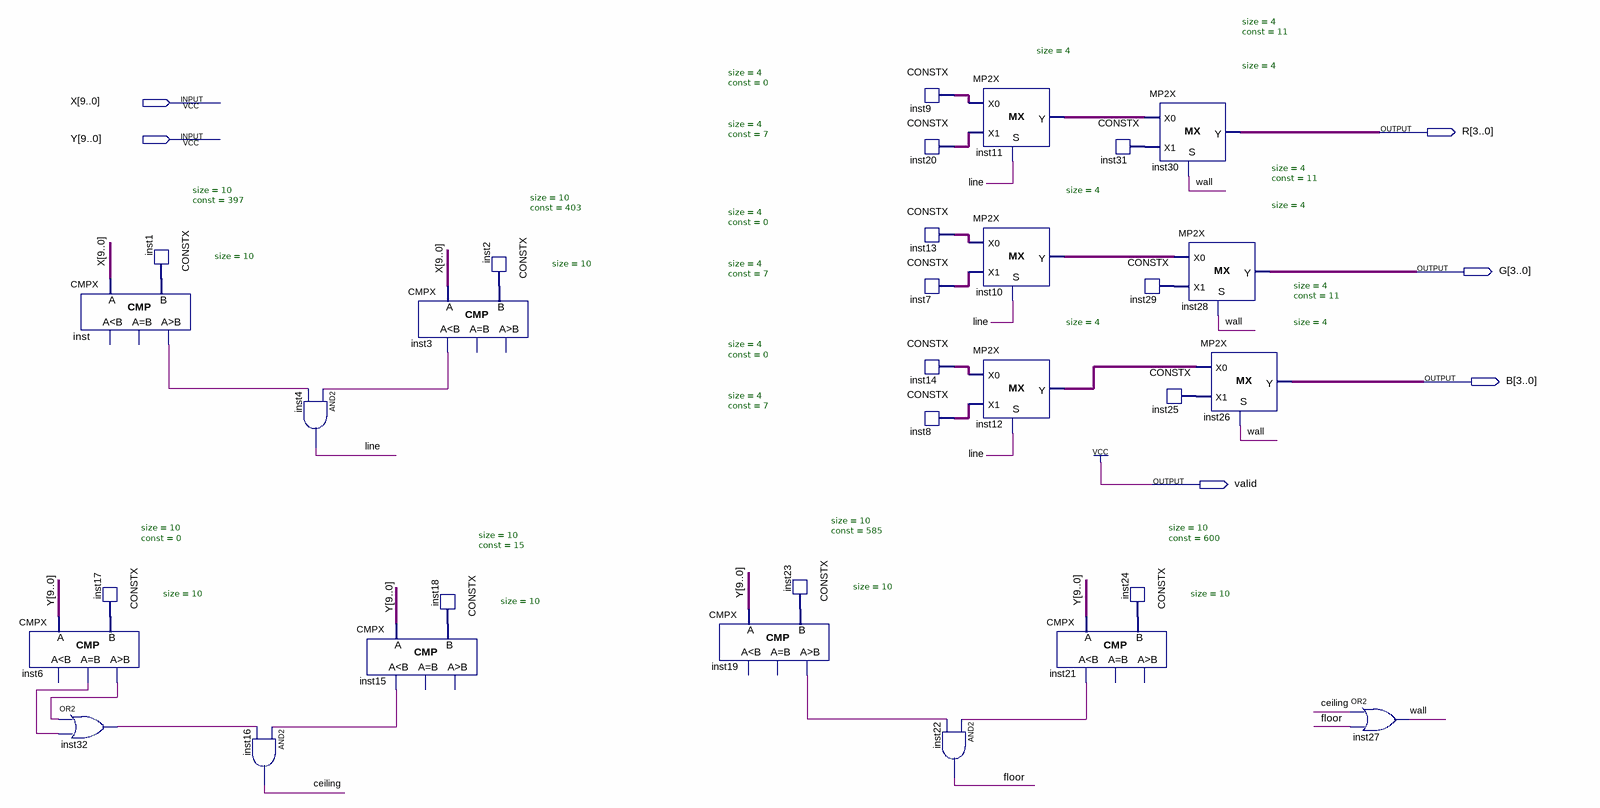
[diagram p0: schematic sheet]
// Quartus schematic Background.bdf as structural Verilog: 32 symbols, 6 pins
module Background (
  input  [9:0] X,
  input  [9:0] Y,
  output [3:0] R,
  output [3:0] G,
  output [3:0] B,
  output valid
);

  wire ceiling, floor, inst3_ls, inst6_eq, inst6_gr, inst15_ls, inst19_gr, inst21_ls, inst32_out, inst_gr,
       line, wall;
  wire [3:0] inst7_data, inst8_data, inst9_data, inst10_y, inst11_y, inst12_y, inst13_data, inst14_data,
       inst20_data, inst25_data, inst29_data, inst31_data;
  wire [9:0] inst1_data, inst2_data, inst17_data, inst18_data, inst23_data, inst24_data;

  CMPX #(.size(10)) inst6 (.A(Y), .B(inst17_data), .eq(inst6_eq), .gr(inst6_gr));  // open: ls
  CMPX #(.size(10)) inst (.A(X), .B(inst1_data), .gr(inst_gr));  // open: ls, eq
  or inst32 (inst32_out, inst6_gr, inst6_eq);
  CONSTX #(.size(10), .\const (397)) inst1 (.data(inst1_data));
  CONSTX #(.size(10), .\const (0)) inst17 (.data(inst17_data));
  and inst16 (ceiling, inst15_ls, inst32_out);
  and inst4 (line, inst3_ls, inst_gr);
  CMPX #(.size(10)) inst15 (.A(Y), .B(inst18_data), .ls(inst15_ls));  // open: eq, gr
  CMPX #(.size(10)) inst3 (.A(X), .B(inst2_data), .ls(inst3_ls));  // open: eq, gr
  CONSTX #(.size(10), .\const (15)) inst18 (.data(inst18_data));
  CONSTX #(.size(10), .\const (403)) inst2 (.data(inst2_data));
  CMPX #(.size(10)) inst19 (.A(Y), .B(inst23_data), .gr(inst19_gr));  // open: ls, eq
  CONSTX #(.size(10), .\const (585)) inst23 (.data(inst23_data));
  CONSTX #(.size(4), .\const (0)) inst9 (.data(inst9_data));
  CONSTX #(.size(4), .\const (7)) inst20 (.data(inst20_data));
  CONSTX #(.size(4), .\const (0)) inst13 (.data(inst13_data));
  CONSTX #(.size(4), .\const (7)) inst7 (.data(inst7_data));
  CONSTX #(.size(4), .\const (0)) inst14 (.data(inst14_data));
  CONSTX #(.size(4), .\const (7)) inst8 (.data(inst8_data));
  and inst22 (floor, inst21_ls, inst19_gr);
  MP2X #(.size(4)) inst11 (.S(line), .X0(inst9_data), .X1(inst20_data), .Y(inst11_y));
  MP2X #(.size(4)) inst10 (.S(line), .X0(inst13_data), .X1(inst7_data), .Y(inst10_y));
  MP2X #(.size(4)) inst12 (.S(line), .X0(inst14_data), .X1(inst8_data), .Y(inst12_y));
  CMPX #(.size(10)) inst21 (.A(Y), .B(inst24_data), .ls(inst21_ls));  // open: eq, gr
  CONSTX #(.size(4), .\const (11)) inst31 (.data(inst31_data));
  CONSTX #(.size(4), .\const (11)) inst29 (.data(inst29_data));
  CONSTX #(.size(10), .\const (600)) inst24 (.data(inst24_data));
  MP2X #(.size(4)) inst30 (.S(wall), .X0(inst11_y), .X1(inst31_data), .Y(R));
  MP2X #(.size(4)) inst28 (.S(wall), .X0(inst10_y), .X1(inst29_data), .Y(G));
  MP2X #(.size(4)) inst26 (.S(wall), .X0(inst12_y), .X1(inst25_data), .Y(B));
  CONSTX #(.size(4), .\const (11)) inst25 (.data(inst25_data));
  or inst27 (wall, ceiling, floor);

  assign valid = 1'b1;
endmodule
